# EAGLE design LINMOD (EAGLE 6.5.0)
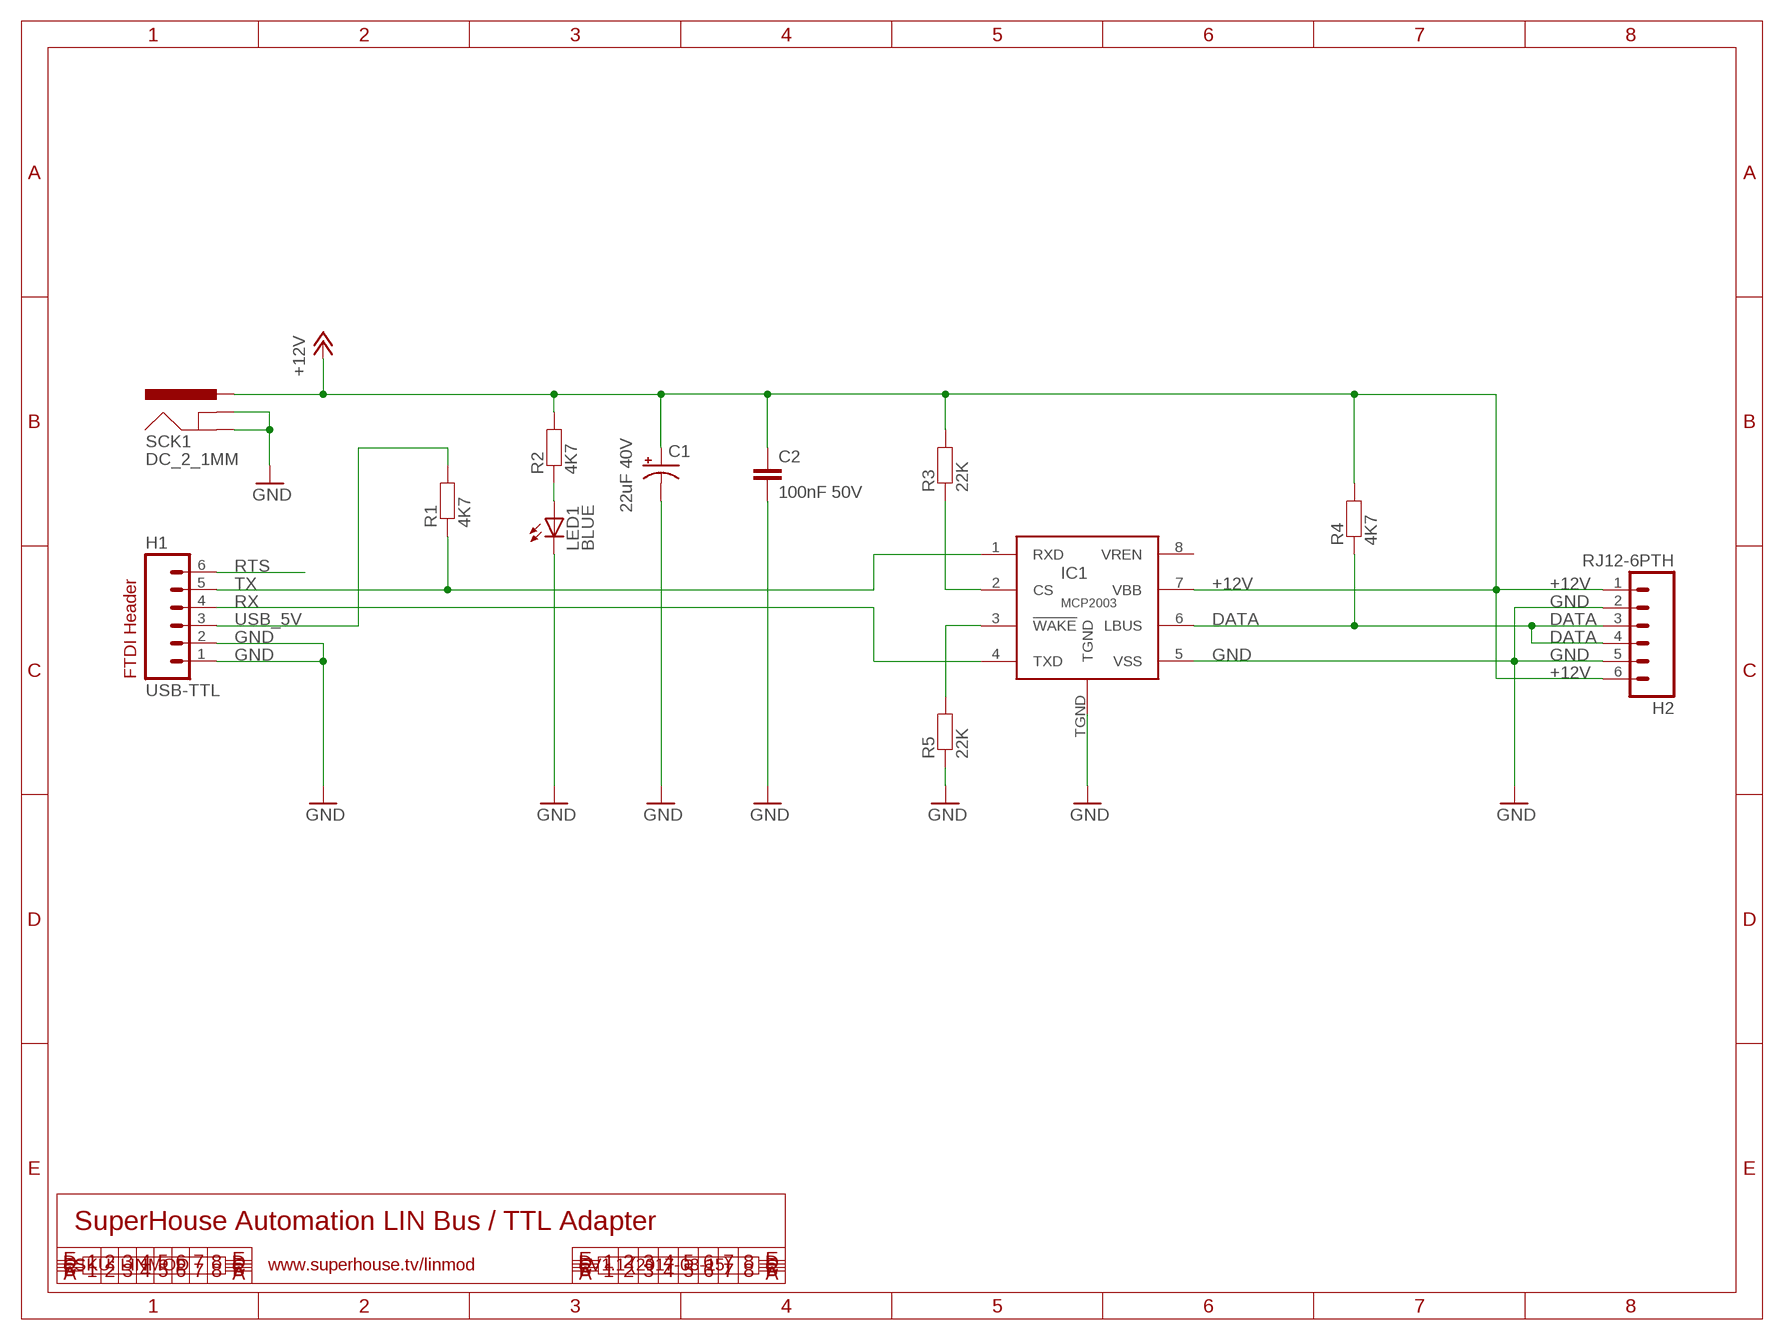
[diagram p0: schematic, sheet 1]

## Parts
C1  22uF 40V  CPOL-USUD-6,3X5,8  [UD-6,3X5,8_NICHICON]
C2  100nF 50V  CAP0603  [0603]
H1  USB-TTL  M06SIP  [1X06]
H2  RJ12-6PTH  [RJ12-6]
IC1  MCP2003  [SOIC8T]
LED1  BLUE  LED0603  [LED-0603]
R1  4K7  RESISTOR0603  [0603]
R2  4K7  RESISTOR0603  [0603]
R3  22K  RESISTOR0603  [0603]
R4  4K7  RESISTOR0603  [0603]
R5  22K  RESISTOR0603  [0603]
SCK1  DC_2_1MM  POWER_JACKPTH  [POWER_JACK_PTH]

## Nets
+12V: C1.+ C2.1 H2.1 H2.6 IC1.7(VBB) R2.2 R3.2 R4.2 SCK1.PWR
DATA: H2.3 H2.4 IC1.6(LBUS) R4.1
GND: C1.- C2.2 H1.1 H1.2 H2.2 H2.5 IC1.5(VSS) IC1.TGND LED1.C R5.1 SCK1.GND SCK1.GNDBREAK
N$1: LED1.A R2.1
N$2: IC1.2(CS) R3.1
N$3: IC1.3(!WAKE) R5.2
RTS: H1.6
RX: H1.4 IC1.4(TXD)
TX: H1.5 IC1.1(RXD) R1.1
USB_5V: H1.3 R1.2
Unconnected: IC1.8(VREN)

## Notes on the sheet
- FTDI Header
- SuperHouse Automation LIN Bus / TTL Adapter
- SKU: LINMOD | www.superhouse.tv/linmod | V1.1 (2017-03-15)

## Library data of the parts
C1 = analyzer:CPOL-US
C2 = freetronics-jon:CAP: Capacitor Standard 0603 ceramic capacitor, and 0.1" leaded capacitor.
H1 = freetronics:M06: Header 6 Standard 6-pin 0.1" header. Use with straight break away headers (SKU : PRT-00116), right angle break away headers (PRT-00553), swiss pins (PRT-00743), machine pins (PRT-00117), and female headers (PRT-00115). Molex polarized connector foot print use with SKU : PRT-08094 with associated crimp pins and housings. NOTES ON THE VARIANTS LOCK and LOCK_LONGPADS... This footprint was designed to help hold the alignment of a through-hole component (i.e. 6-pin header) while soldering it into place. You may notice that each hole has been shifted either up or down by 0.005 of an inch from it's more standard position (which is a perfectly straight line). This slight alteration caused the pins (the squares in the middle) to touch the edges of the holes. Because they are alternating, it causes a "brace" to hold the component in place. 0.005 has proven to be the perfect amount of "off-center" position when using our standard breakaway headers. Although looks a little odd when you look at the bare footprint, once you have a header in there, the alteration is very hard to notice. Also, if you push a header all the way into place, it is covered up entirely on the bottom side. This idea of altering the position of holes to aid alignment will be further integrated into the Sparkfun Library for other footprints. It can help hold any component with 3 or more connection pins.
H2 = freetronics-jon:RJ12-6
IC1 = freetronics-jon:MCP2003
LED1 = freetronics-jon:LED: LEDs Standard schematic elements and footprints for 5mm, 3mm, 1206, and 0603 sized LEDs. 5mm - Spark Fun Electronics SKU : COM-00529 (and others)
R1-R5 = freetronics-jon:RESISTOR: Resistor Basic schematic elements and footprints for 0603, 1206, and PTH 1/10th watt (small) resistors.
SCK1 = freetronics:POWER_JACK: Power Jack This is the standard 5.5mm barrel jack for power. The PTH is the most common, proven, reliable, footprint. All others are experimental. The Slot footprint only works if the mill layer is transmitted to the PCB fab house so be warned. Spark Fun Electronics SKU : PRT-00119. Mating wall wart : TOL-00298 (and others)

## Net classes
1 power: width 0.254 mm

## Board
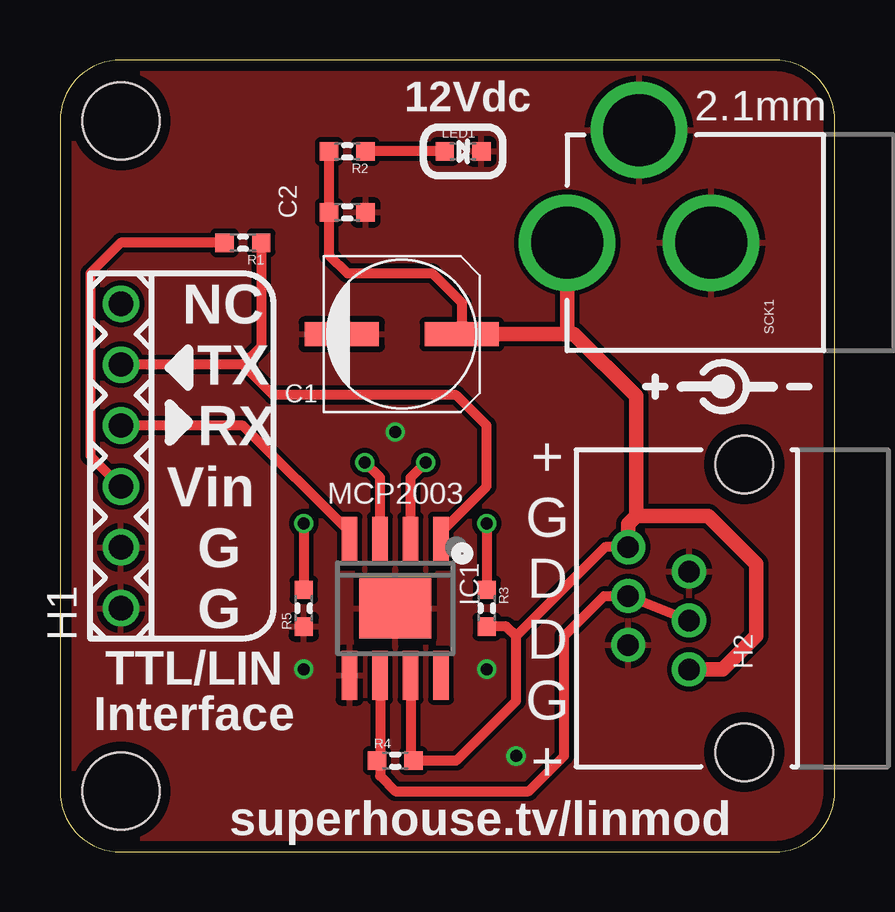
[diagram p1: board, top side]
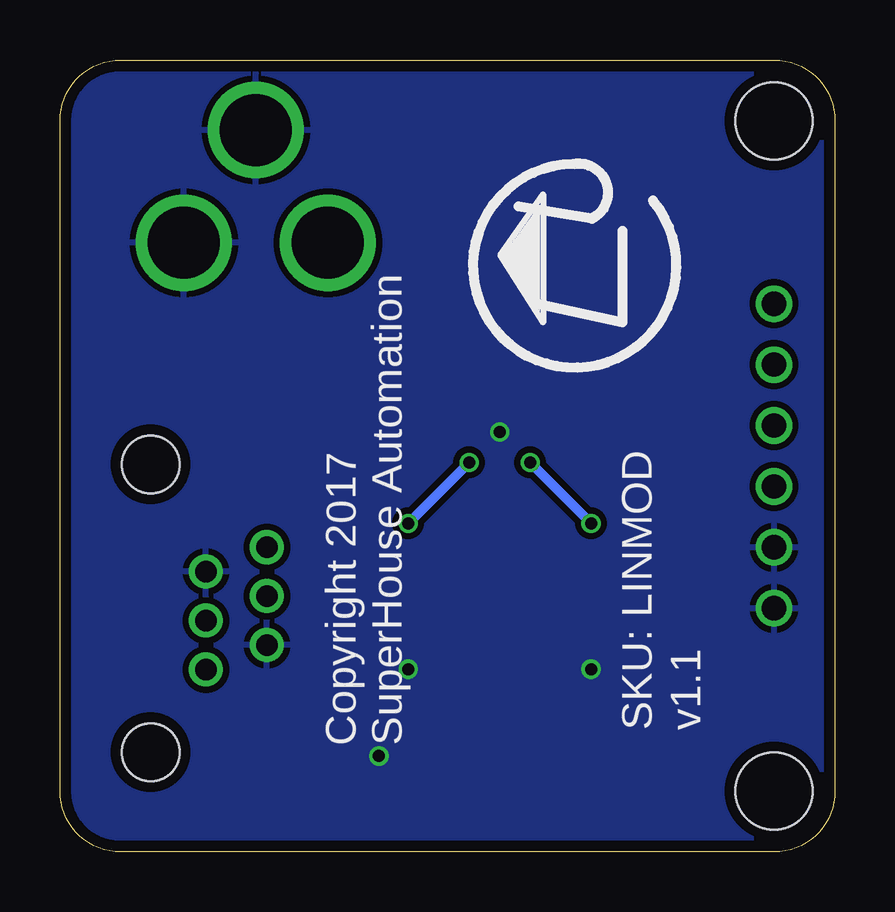
[diagram p2: board, bottom side, seen from below]

Size 32.29 x 33.02 mm. Coordinates in mm from the lower left corner, seen from the top.
Outline: 29.75,33.02 2.54,33.02 arc90 0,30.48 0,2.54 arc90 2.54,0 29.75,0 arc90 32.29,2.54 32.29,30.48 arc90 29.75,33.02
Copper layers (1*16): Top 0.035mm / dielectric 1.5mm / Bottom 0.035mm
Design rules "ET-design-rules": minimum track width 8mil, minimum drill 15mil, track to track 8mil, track to pad 8mil, pad to pad 8mil, via to via 8mil, smd to smd 8mil, copper to edge 18mil, drill to drill 8mil, minimum pad ring 10mil, minimum via ring 6mil, stop-mask expansion 4mil, vias tented up to drill 25mil, thermal gap 10mil
Holes 3.2 mm at 2.54,30.48 2.54,2.54

### Footprints (pad centres in the part's own frame; a part is rotated, then mirrored left to right if it is on the bottom)
UD-6,3X5,8_NICHICON = smd 3.1 x 1: + 2.5,0; - -2.5,0
0603 = smd 0.762 x 0.762: 1 -0.762,0; 2 0.762,0
1X06 = drill 1.016: 1 0,0; 2 2.54,0; 3 5.08,0; 4 7.62,0; 5 10.16,0; 6 12.7,0
RJ12-6 = drill 0.9 pad 1.422: 1 -2.55,0; 2 -1.53,2.54; 3 -0.51,0; 4 0.51,2.54; 5 1.53,0; 6 2.55,2.54 | hole 2.4: -6,-2.3; 6,-2.3
SOIC8T = smd 2.032 x 0.66: 1 -2.794,1.905; 2 -2.794,0.635; 3 -2.794,-0.635; 4 -2.794,-1.905; 5 2.794,-1.905; 6 2.794,-0.635; 7 2.794,0.635; 8 2.794,1.905 | smd 2.489 x 2.997: TGND 0,0
LED-0603 = smd 0.762 x 0.762: A -0.762,0; C 0.762,0
POWER_JACK_PTH = drill 2.997: GND 0,7.7; GNDBREAK 4.7,10.7; PWR 0,13.7

### Placement (x,y rotation side)
C1  14.24,21.59 0 top
C2  11.97,26.67 0 top
H1  2.54,10.16 90 top
H2  26.21,10.16 90 top
IC1  13.97,10.16 270 top
LED1  16.8,29.21 0 top
R1  7.62,25.4 180 top
R2  11.97,29.21 180 top
R3  17.78,10.16 270 top
R4  13.97,3.81 0 top
R5  10.16,10.16 90 top
SCK1  34.83,25.4 90 top

### Tracks (layer width: path | path; a pad name or v marks a point on that pad's centre or on a via)
+12V
  Top 0.406: IC1.7 14.61,3.94 R4.2 16.51,3.81 19,6.3 19,9 | R2.2 C2.1 11.21,24.89 11.97,24.13 15.51,24.13 16.74,22.9 C1.+ | 19,9 18.6,9.4 R3.2 | H2.6 22.71,12.71 19,9
  Top 0.61: H2.1 27.61,7.61 29,9 29,12 27,14 24,14 | C1.+ 21,21.59 | 21,21.59 21.41,21.59 24,19 24,14 | SCK1.PWR 21.13,21.72 21,21.59 | 24,14 23.67,13.67 H2.6
DATA
  Top 0.406: IC1.6 13.34,3.94 | 13.34,3.94 R4.1 | 13.34,3.94 13.34,3.17 13.97,2.54 19.54,2.54 21,4 21,9 22.67,10.67 H2.4 H2.3
GND  (via drill 0.5)
  other vias: 13.97,17.51 17.78,7.62 10.16,7.62 19,4
  pour Bottom (isolate 0.254): 32.29,30.48 32.29,2.54 arc-90 29.75,0 2.54,0 arc-90 0,2.54 0,30.48 arc-90 2.54,33.02 29.75,33.02 arc-90
  pour Top: 29.75,33.02 2.54,33.02 arc90 0,30.48 0,2.54 arc90 2.54,0 29.75,0 arc90 32.29,2.54 32.29,30.48 arc90
N$1
  Top 0.406: LED1.A R2.1
N$2  (via drill 0.5)
  Top 0.406: IC1.2 14.61,15.61 v15.24,16.24 | v17.78,13.7 R3.1
  Bottom 0.406: v15.24,16.24 v17.78,13.7
N$3  (via drill 0.5)
  Top 0.406: IC1.3 13.34,15.61 v12.7,16.24 | v10.16,13.7 R5.2
  Bottom 0.406: v12.7,16.24 v10.16,13.7
RX
  Top 0.406: H1.4 7.62,17.78 12.06,13.34 IC1.4
TX
  Top 0.406: 7.62,20.32 8.89,19.05 16.51,19.05 17.78,17.78 17.78,15.24 15.88,13.34 IC1.1 | 7.62,20.32 H1.5 | R1.1 8.38,21.08 7.62,20.32
USB_5V
  Top 0.406: R1.2 2.54,25.4 1.27,24.13 1.27,16.51 H1.3

### Text on the board
tPlace: 12Vdc | 2.1mm | NC | TX | RX | + | Vin | MCP2003 | G | G | D | G | D | G | TTL/LIN / Interface | + | superhouse.tv/linmod
bPlace: v1.1 | SKU: LINMOD | Copyright 2017 / SuperHouse Automation